# Altium schematic sheet 凌霄IMU模块接口原理图.SchDoc
size A4
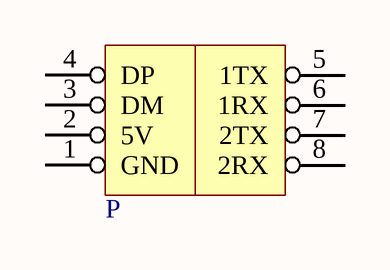
[diagram p0: 凌霄IMU模块接口原理图.SchDoc]

## Parts
P  IMU_LX  [IMU_LX]  (value not drawn)

## Nets

Not connected (* = marked no-connect by the designer): P 1(GND) 2(5V) 3(DM) 4(DP) 5(1TX) 6(1RX) 7(2TX) 8(2RX)